# EAGLE design LoopV2.6 (EAGLE 9.4.2)
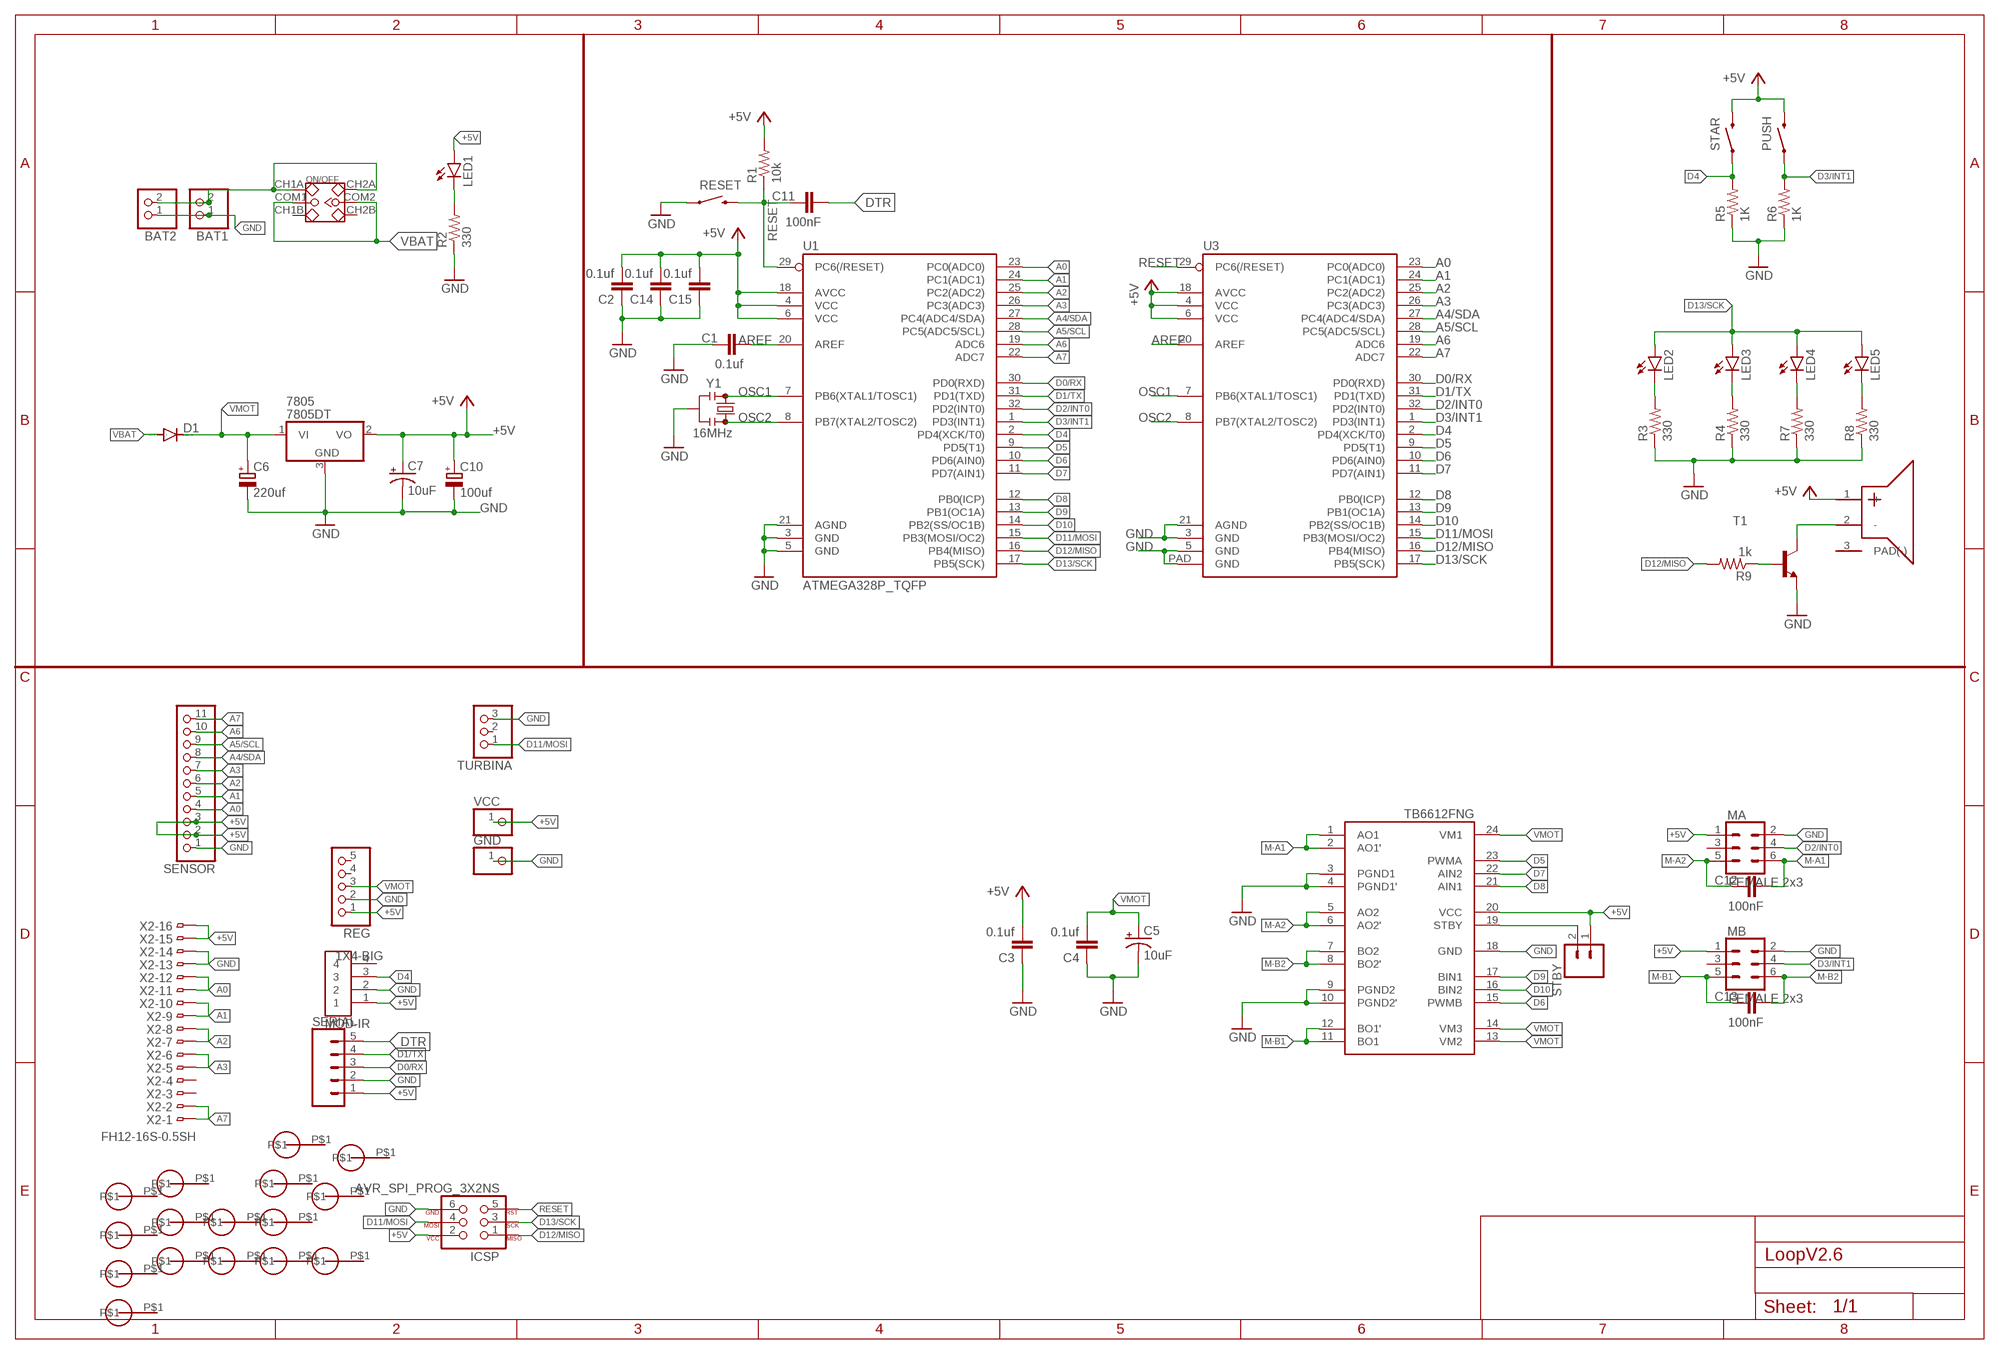
[diagram p0: schematic, sheet 1]

## Parts
7805  7805DT  [TO252]
BAT1  PINHD-1X2  [1X02]
BAT2  PINHD-1X2  [1X02]
C1  0.1uf  C-EUC0805K  [C0805K]
C2  0.1uf  C-EUC0805K  [C0805K]
C3  0.1uf  C-EUC0805K  [C0805K]
C4  0.1uf  C-EUC0805K  [C0805K]
C5  10uF  10UF-POLAR-EIA3216-16V-10%(TANT)  [EIA3216]
C6  220uf  CPOL-EU175TMP-0808  [175TMP-0808]
C7  10uF  10UF-POLAR-EIA3216-16V-10%(TANT)  [EIA3216]
C10  100uf  CPOL-EU153CLV-0605  [153CLV-0605]
C11  100nF  C-EUC0805K  [C0805K]
C12  100nF  C-EUC0805K  [C0805K]
C13  100nF  C-EUC0805K  [C0805K]
C14  0.1uf  C-EUC0805K  [C0805K]
C15  0.1uf  C-EUC0805K  [C0805K]
D1  DIODE-DO214AA  [DO214AA]
GND  PINHD-1X1CB  [1X01-CLEANBIG]
IC1  TB6612FNG  [SSOP24]
ICSP  AVR_SPI_PROG_3X2NS  [2X3-NS]
LED1  LEDCHIPLED_0805  [CHIPLED_0805]
LED2  LEDCHIPLED_0805  [CHIPLED_0805]
LED3  LEDCHIPLED_0805  [CHIPLED_0805]
LED4  LEDCHIPLED_0805  [CHIPLED_0805]
LED5  LEDCHIPLED_0805  [CHIPLED_0805]
MA  FEMALE 2x3  CONN_03X2FEMALE  [2X3]
MB  FEMALE 2x3  CONN_03X2FEMALE  [2X3]
MOD-IR  1X4-BIG  [1X04-BIG]
ON/OFF  SWITCH-8.53.5MM-THT  [SWITCH-8.5*3.5MM-THT]
PUSH  TESTING_SWITCH-MOMENTARY-2SMD  [TESTING_TACTILE_SWITCH_SMD]
R1  10k  R-US_R0805  [R0805]
R2  330  R-US_R0805  [R0805]
R3  330  R-US_R0805  [R0805]
R4  330  R-US_R0805  [R0805]
R5  1K  R-US_R0805  [R0805]
R6  1K  R-US_R0805  [R0805]
R7  330  R-US_R0805  [R0805]
R8  330  R-US_R0805  [R0805]
R9  1k  R-US_R0805  [R0805]
REG  PINHD-1X5  [1X05]
RESET  TESTING_SWITCH-MOMENTARY-2SMD  [TESTING_TACTILE_SWITCH_SMD]
SENSOR  PINHD-1X11  [1X11]
SERIAL  CONN_05  [1X05]
STAR  TESTING_SWITCH-MOMENTARY-2SMD  [TESTING_TACTILE_SWITCH_SMD]
STBY  CONN_02  [1X02]
T1  -NPN-SOT23-EBC  [SOT23-EBC]
TURBINA  PINHD-1X3  [1X03]
U1  ATMEGA328P_TQFP  [TQFP32-08]
U3  ATMEGA328P_MLFMLF32  [MLF32-PAD]
U$4  PAD2  [PAD-2.2MM]
U$5  PAD2  [PAD-2.2MM]
U$6  PAD2  [PAD-2.2MM]
U$7  PAD2  [PAD-2.2MM]
U$8  PAD2  [PAD-2.2MM]
U$9  PAD2  [PAD-2.2MM]
U$10  PAD2  [PAD-2.2MM]
U$11  PAD2  [PAD-2.2MM]
U$12  PAD2  [PAD-2.2MM]
U$13  PAD2  [PAD-2.2MM]
U$14  PAD2  [PAD-2.2MM]
U$15  PAD2  [PAD-2.2MM]
U$16  BUZZER-KLJ-5030  [BUZZERSMD]
U$17  PAD2  [PAD-2.2MM]
U$18  PAD2  [PAD-2.2MM]
U$19  PAD2  [PAD-2.2MM]
U$20  PAD2  [PAD-2.2MM]
VCC  PINHD-1X1CB  [1X01-CLEANBIG]
X2  FH12-16S-0.5SH  [FH12-16S-0.5SH]
Y1  16MHz  RESONATOR-16MHZSMD_3.2X1.3  [RESONATOR-SMD-3.2X1.3]

## Nets
+5V: 7805.2(VO) C2.2 C3.2 C7.+ C10.+ C14.2 C15.2 IC1.20(VCC) ICSP.2 LED1.A MA.1 MB.1 MOD-IR.1 PUSH.3 R1.2 REG.1 SENSOR.2 SENSOR.3 SERIAL.1 STAR.3 STBY.1 U1.4(VCC) U1.6(VCC) U1.18(AVCC) U3.4(VCC) U3.6(VCC) U3.18(AVCC) U$16.1(+) VCC.1 X2.15 X2.16
A0: SENSOR.4 U1.23(PC0(ADC0)) U3.23(PC0(ADC0)) X2.11 X2.12
A1: SENSOR.5 U1.24(PC1(ADC1)) U3.24(PC1(ADC1)) X2.9 X2.10
A2: SENSOR.6 U1.25(PC2(ADC2)) U3.25(PC2(ADC2)) X2.7 X2.8
A3: SENSOR.7 U1.26(PC3(ADC3)) U3.26(PC3(ADC3)) X2.5 X2.6
A4/SDA: SENSOR.8 U1.27(PC4(ADC4/SDA)) U3.27(PC4(ADC4/SDA))
A5/SCL: SENSOR.9 U1.28(PC5(ADC5/SCL)) U3.28(PC5(ADC5/SCL))
A6: SENSOR.10 U1.19(ADC6) U3.19(ADC6)
A7: SENSOR.11 U1.22(ADC7) U3.22(ADC7) X2.1 X2.2
AREF: C1.2 U1.20(AREF) U3.20(AREF)
D0/RX: SERIAL.3 U1.30(PD0(RXD)) U3.30(PD0(RXD))
D1/TX: SERIAL.4 U1.31(PD1(TXD)) U3.31(PD1(TXD))
D2/INT0: MA.4 U1.32(PD2(INT0)) U3.32(PD2(INT0))
D3/INT1: MB.4 PUSH.1 R6.2 U1.1(PD3(INT1)) U3.1(PD3(INT1))
D4: MOD-IR.3 R5.2 STAR.1 U1.2(PD4(XCK/T0)) U3.2(PD4(XCK/T0))
D5: IC1.23(PWMA) U1.9(PD5(T1)) U3.9(PD5(T1))
D6: IC1.15(PWMB) U1.10(PD6(AIN0)) U3.10(PD6(AIN0))
D7: IC1.22(AIN2) U1.11(PD7(AIN1)) U3.11(PD7(AIN1))
D8: IC1.21(AIN1) U1.12(PB0(ICP)) U3.12(PB0(ICP))
D9: IC1.17(BIN1) U1.13(PB1(OC1A)) U3.13(PB1(OC1A))
D10: IC1.16(BIN2) U1.14(PB2(SS/OC1B)) U3.14(PB2(SS/OC1B))
D11/MOSI: ICSP.4 TURBINA.1 U1.15(PB3(MOSI/OC2)) U3.15(PB3(MOSI/OC2))
D12/MISO: ICSP.1 R9.2 U1.16(PB4(MISO)) U3.16(PB4(MISO))
D13/SCK: ICSP.3 LED2.A LED3.A LED4.A LED5.A U1.17(PB5(SCK)) U3.17(PB5(SCK))
DTR: C11.2 SERIAL.5
GND: 7805.3(GND) BAT1.1 BAT2.1 C1.1 C2.1 C3.1 C4.1 C5.- C6.- C7.- C10.- C14.1 C15.1 GND.1 IC1.3(PGND1) IC1.4(PGND1') IC1.9(PGND2) IC1.10(PGND2') IC1.18(GND) ICSP.6 MA.2 MB.2 MOD-IR.2 R2.1 R3.1 R4.1 R5.1 R6.1 R7.1 R8.1 REG.2 RESET.1 SENSOR.1 SERIAL.2 T1.E TURBINA.3 U1.3(GND) U1.5(GND) U1.21(AGND) U3.3(GND) U3.5(GND) U3.21(AGND) U3.PAD(GND) X2.13 X2.14 Y1.2
M-A1: C12.2 IC1.1(AO1) IC1.2(AO1') MA.6
M-A2: C12.1 IC1.5(AO2) IC1.6(AO2') MA.5
M-B1: C13.1 IC1.11(BO1) IC1.12(BO1') MB.5
M-B2: C13.2 IC1.7(BO2) IC1.8(BO2') MB.6
N$1: LED1.C R2.2
N$3: T1.C U$16.2(-)
N$4: LED4.C R7.2
N$5: LED2.C R3.2
N$6: LED3.C R4.2
N$7: LED5.C R8.2
N$9: R9.1 T1.B
N$10: IC1.19(STBY) STBY.2
N$12: BAT1.2 BAT2.2 ON/OFF.CH1A ON/OFF.CH2A
OSC1: U1.7(PB6(XTAL1/TOSC1)) U3.7(PB6(XTAL1/TOSC1)) Y1.1
OSC2: U1.8(PB7(XTAL2/TOSC2)) U3.8(PB7(XTAL2/TOSC2)) Y1.3
RESET: C11.1 ICSP.5 R1.1 RESET.3 U1.29(PC6(/RESET)) U3.29(PC6(/RESET))
VBAT: D1.A ON/OFF.COM1 ON/OFF.COM2
VMOT: 7805.1(VI) C4.2 C5.+ C6.+ D1.C IC1.13(VM2) IC1.14(VM3) IC1.24(VM1) REG.3
Unconnected: MA.3 MB.3 MOD-IR.4 ON/OFF.CH1B ON/OFF.CH2B REG.4 REG.5 TURBINA.2 U$4.P$1 U$5.P$1 U$6.P$1 U$7.P$1 U$8.P$1 U$9.P$1 U$10.P$1 U$11.P$1 U$12.P$1 U$13.P$1 U$14.P$1 U$15.P$1 U$16.3(PAD(-)) U$17.P$1 U$18.P$1 U$19.P$1 U$20.P$1 X2.3 X2.4

## Library data of the parts
7805 = adafruit:78*: Positive VOLTAGE REGULATOR Added bigger pads to the TO-92 package
BAT1 BAT2 = pinhead:PINHD-1X2: PIN HEADER
C1-C4 C11-C15 = rcl:C-EU: CAPACITOR, European symbol; SPICEPREFIX: C
C5 C7 = SparkFun-Capacitors:10UF-POLAR: 10.0µF polarized capacitors A capacitor is a passive two-terminal electrical component used to store electrical energy temporarily in an electric field.; PROD_ID: CAP-00811
C6 C10 = rcl:CPOL-EU: POLARIZED CAPACITOR, European symbol; SPICEPREFIX: C
D1 = diode:DIODE-: DIODE
GND VCC = adafruit:PINHD-1X1: Pin header 1x1 for 0.1" spacing With round pins
IC1 = adafruit:TB6612FNG: TB6612FNG MOS dual H-bridge motor driver, 1.2A current 3.2A peak 3 or 5v logic and 3-15v motor
ICSP = SparkFun-Connectors:AVR_SPI_PROG_3X2: AVR ISP 6 Pin This is the reduced ISP connector for AVR programming. Common on Arduino. This footprint will take up less PCB space and can be used with a 10-pin to 6-pin adapter such as SKU: BOB-08508 **Special note about "TEST_POINT" package. The stop mask is on the top side, so if you want your programming test points to be on the bottom of your board, make sure to place this package on the bottom side of the board. This also ensure that the orientation to program from the bottom side will be correct. SparkFun Products: SparkFun ISP Pogo Adapter - NS Tiny AVR Programmer -PTH
LED1-LED5 = led:LED: LED OSRAM: - CHIPLED LG R971, LG N971, LY N971, LG Q971, LY Q971, LO R971, LY R971 LH N974, LH R974 LS Q976, LO Q976, LY Q976 LO Q996 - Hyper CHIPLED LW Q18S LB Q993, LB Q99A, LB R99A - SideLED LS A670, LO A670, LY A670, LG A670, LP A670 LB A673, LV A673, LT A673, LW A673 LH A674 LY A675 LS A676, LA A676, LO A676, LY A676, LW A676 LS A679, LY A679, LG A679 - Hyper Micro SIDELED® LS Y876, LA Y876, LO Y876, LY Y876 LT Y87S - SmartLED LW L88C, LW L88S LB L89C, LB L89S, LG L890 LS L89K, LO L89K, LY L89K LS L896, LA L896, LO L896, LY L896 - TOPLED LS T670, LO T670, LY T670, LG T670, LP T670 LSG T670, LSP T670, LSY T670, LOP T670, LYG T670 LG T671, LOG T671, LSG T671 LB T673, LV T673, LT T673, LW T673 LH T674 LS T676, LA T676, LO T676, LY T676, LB T676, LH T676, LSB T676, LW T676 LB T67C, LV T67C, LT T67C, LS T67K, LO T67K, LY T67K, LW E67C LS E67B, LA E67B, LO E67B, LY E67B, LB E67C, LV E67C, LT E67C LW T67C LS T679, LY T679, LG T679 LS T770, LO T770, LY T770, LG T770, LP T770 LB T773, LV T773, LT T773, LW T773 LH T774 LS E675, LA E675, LY E675, LS T675 LS T776, LA T776, LO T776, LY T776, LB T776 LHGB T686 LT T68C, LB T68C - Hyper Mini TOPLED® LB M676 - Mini TOPLED Santana® LG M470 LS M47K, LO M47K, LY M47K Source: http://www.osram.convergy.de LUXEON: - LUMILED® LXK2-PW12-R00, LXK2-PW12-S00, LXK2-PW14-U00, LXK2-PW14-V00 LXK2-PM12-R00, LXK2-PM12-S00, LXK2-PM14-U00 LXK2-PE12-Q00, LXK2-PE12-R00, LXK2-PE12-S00, LXK2-PE14-T00, LXK2-PE14-U00 LXK2-PB12-K00, LXK2-PB12-L00, LXK2-PB12-M00, LXK2-PB14-N00, LXK2-PB14-P00, LXK2-PB14-Q00 LXK2-PR12-L00, LXK2-PR12-M00, LXK2-PR14-Q00, LXK2-PR14-R00 LXK2-PD12-Q00, LXK2-PD12-R00, LXK2-PD12-S00 LXK2-PH12-R00, LXK2-PH12-S00 LXK2-PL12-P00, LXK2-PL12-Q00, LXK2-PL12-R00 Source: www.luxeon.com KINGBRIGHT: KA-3528ASYC Source: www.kingbright.com
MA MB = SparkFun-Connectors:CONN_03X2: Multi connection point. Often used as Generic Header-pin footprint for 0.1 inch spaced/style header connections You can populate with any combo of single row headers, but if you'd like an exact match, check these: Header - 2x3 (Male, 0.1") (PRT-12807) Header - 2x3 (Female, 0.1") (PRT-13010) 2x3 Pin Shrouded Header (PRT-10877) On any of the 0.1 inch spaced packages, you can populate with these: Break Away Headers - Straight (PRT-00116) Break Away Male Headers - Right Angle (PRT-00553) Female Headers (PRT-00115) Break Away Headers - Machine Pin (PRT-00117) Break Away Female Headers - Swiss Machine Pin (PRT-00743) Special note: the shrouded connector mates well with our 3x2 ribbon cables: Ribbon Crimp Connector - 6-pin (2x3, Female) (PRT-10651) Ribbon Cable - 6 wire (15ft) (PRT-10646); PROD_ID: CONN-11566
MOD-IR = adafruit:1X4: 4-pin connector
ON/OFF = Switch-JR:SWITCH-8.5*3.5MM-THT: 311010004; MPN: MS-22D18 G2 ROHS
PUSH RESET STAR = PUSH-SMD:TESTING_SWITCH-MOMENTARY-2: Various NO switches- pushbuttons, reed, etc; PROD_ID: SWCH-08247
R1-R9 = rcl:R-US_: RESISTOR, American symbol; SPICEPREFIX: R
REG = pinhead:PINHD-1X5: PIN HEADER
SENSOR = pinhead:PINHD-1X11: PIN HEADER
SERIAL = SparkFun-Connectors:CONN_05: Multi connection point. Often used as Generic Header-pin footprint for 0.1 inch spaced/style header connections On any of the 0.1 inch spaced packages, you can populate with these: Break Away Headers - Straight (PRT-00116) Break Away Male Headers - Right Angle (PRT-00553) Female Headers (PRT-00115) Break Away Headers - Machine Pin (PRT-00117) Break Away Female Headers - Swiss Machine Pin (PRT-00743) For SCREWTERMINALS and SPRING TERMINALS visit here: Screw Terimnals on SparkFun.com (5mm/3.5mm/2.54mm spacing) This device is also useful as a general connection point to wire up your design to another part of your project. Our various solder wires solder well into these plated through hole pads. Hook-Up Wire - Assortment (Stranded, 22 AWG) (PRT-11375) Hook-Up Wire - Assortment (Solid Core, 22 AWG) (PRT-11367) View the entire wire category on our website here Special notes: Molex polarized connector foot print use with SKU : PRT-08231 with associated crimp pins and housings. 1MM SMD Version SKU: PRT-10208
STBY = SparkFun-Connectors:CONN_02: Multi connection point. Often used as Generic Header-pin footprint for 0.1 inch spaced/style header connections On any of the 0.1 inch spaced packages, you can populate with these: Break Away Headers - Straight (PRT-00116) Break Away Male Headers - Right Angle (PRT-00553) Female Headers (PRT-00115) Break Away Headers - Machine Pin (PRT-00117) Break Away Female Headers - Swiss Machine Pin (PRT-00743) For SCREWTERMINALS and SPRING TERMINALS visit here: Screw Terimnals on SparkFun.com (5mm/3.5mm/2.54mm spacing) This device is also useful as a general connection point to wire up your design to another part of your project. Our various solder wires solder well into these plated through hole pads. Hook-Up Wire - Assortment (Stranded, 22 AWG) (PRT-11375) Hook-Up Wire - Assortment (Solid Core, 22 AWG) (PRT-11367) View the entire wire category on our website here Special notes: Molex polarized connector foot print use with: PRT-08233 with associated crimp pins and housings. 2.54_SCREWTERM for use with PRT-10571. 3.5mm Screw Terminal footprints for PRT-08084 5mm Screw Terminal footprints for use with PRT-08432
T1 = transistor-neu-to92:*-NPN-: NPN Transistror
TURBINA = adafruit:PINHD-1X3: PIN HEADER
U1 = SparkFun-IC-Microcontroller:ATMEGA328P_TQFP: Popular 328P in QFP Storefront component: ATmega328 - TQFP (COM-13448) Datasheet SparkFun Products SparkFun RedBoard - Programmed with Arduino (DEV-12757) Arduino Pro Mini 328 - 5V/16MHz (DEV-11113) Arduino Pro Mini 328 - 3.3V/8MHz (DEV-11114) SparkFun OpenLog (DEV-13712) SparkFun MicroView - OLED Arduino Module (DEV-12923) SparkFun Digital Sandbox (DEV-12651) SparkFun PicoBoard (WIG-11888) Arduino Fio (DEV-10116) LilyPad Arduino 328 Main Board (DEV-13342) SparkFun RedStick (DEV-13741) LilyPad MP3 (DEV-11013) LilyPad Arduino SimpleSnap (DEV-10941) SparkFun Stepoko (ROB-13899) SparkFun Geiger Counter (SEN-11345) SparkFun EL Sequencer (COM-12781) Arduino Pro 328 - 5V/16MHz (DEV-10915) CryptoCape (DEV-12773) SparkFun IR Thermometer Evaluation Board - MLX90614 (SEN-10740) SparkFun RedBot Mainboard (ROB-12097) Arduino Pro 328 - 3.3V/8MHz (DEV-10914) SparkFun Block for Intel® Edison - Arduino (DEV-13036) SparkFun Simon Says - Surface Mount Soldering Kit (KIT-10935) SparkFun 7-Segment Serial Display - Red (COM-11441) SparkFun 7-Segment Serial Display - White (COM-11629) SparkFun 7-Segment Serial Display - Yellow (COM-11443) SparkFun 7-Segment Serial Display - Kelly Green (COM-11440) SparkFun 7-Segment Serial Display - Blue (COM-11442) SparkFun OpenSegment Serial Display - 20mm (Blue) (COM-11647) SparkFun OpenSegment Serial Display - 20mm (Green) (COM-11646) SparkFun OpenSegment Serial Display - 20mm (White) (COM-11648) SparkFun OpenSegment Serial Display - 20mm (Red) (COM-11644) SparkFun OpenSegment Serial Display - 20mm (Yellow) (COM-11645) SparkFun OpenSegment Shield (DEV-13190); PROD_ID: IC-09069
U3 = SparkFun-IC-Microcontroller:ATMEGA328P_MLF: Datasheet SparkFun Products () () 32-Pin Atmega328 part Commonly used on Arduino compatible boards Available in QFP and QFN packages TQFP is IC-09069 QFN is non-stock
U$4-U$15 U$17-U$20 = Pads-JR:PAD2
U$16 = ComponentesJR:BUZZER-KLJ-5030
X2 = con-hirose:FH12-16S-0.5S: 0.5mm Pitch Connectors For FPC/FFC Source: Data sheet; MPN: FH12-16S-0.5SH(55); OC_FARNELL: 1324546; OC_NEWARK: 34M6162
Y1 = SparkFun-Clocks:RESONATOR-16MHZ: 16MHz Resonator Digikey Example <http://www.digikey.com/product-detail/en/murata-electronics-north-america/CSTCE16M0V53-R0/490-1198-1-ND/584635> Frequency: 16MHz Frequency Stability: ±0.3% Frequency Tolerance: ±0.5% Capacitance: 15pF SparkFun Products SparkFun OpenLog <https://www.sparkfun.com/products/13712> SparkFun MicroView - OLED Arduino Module <https://www.sparkfun.com/products/12923>; PROD_ID: XTAL-08900

## Board
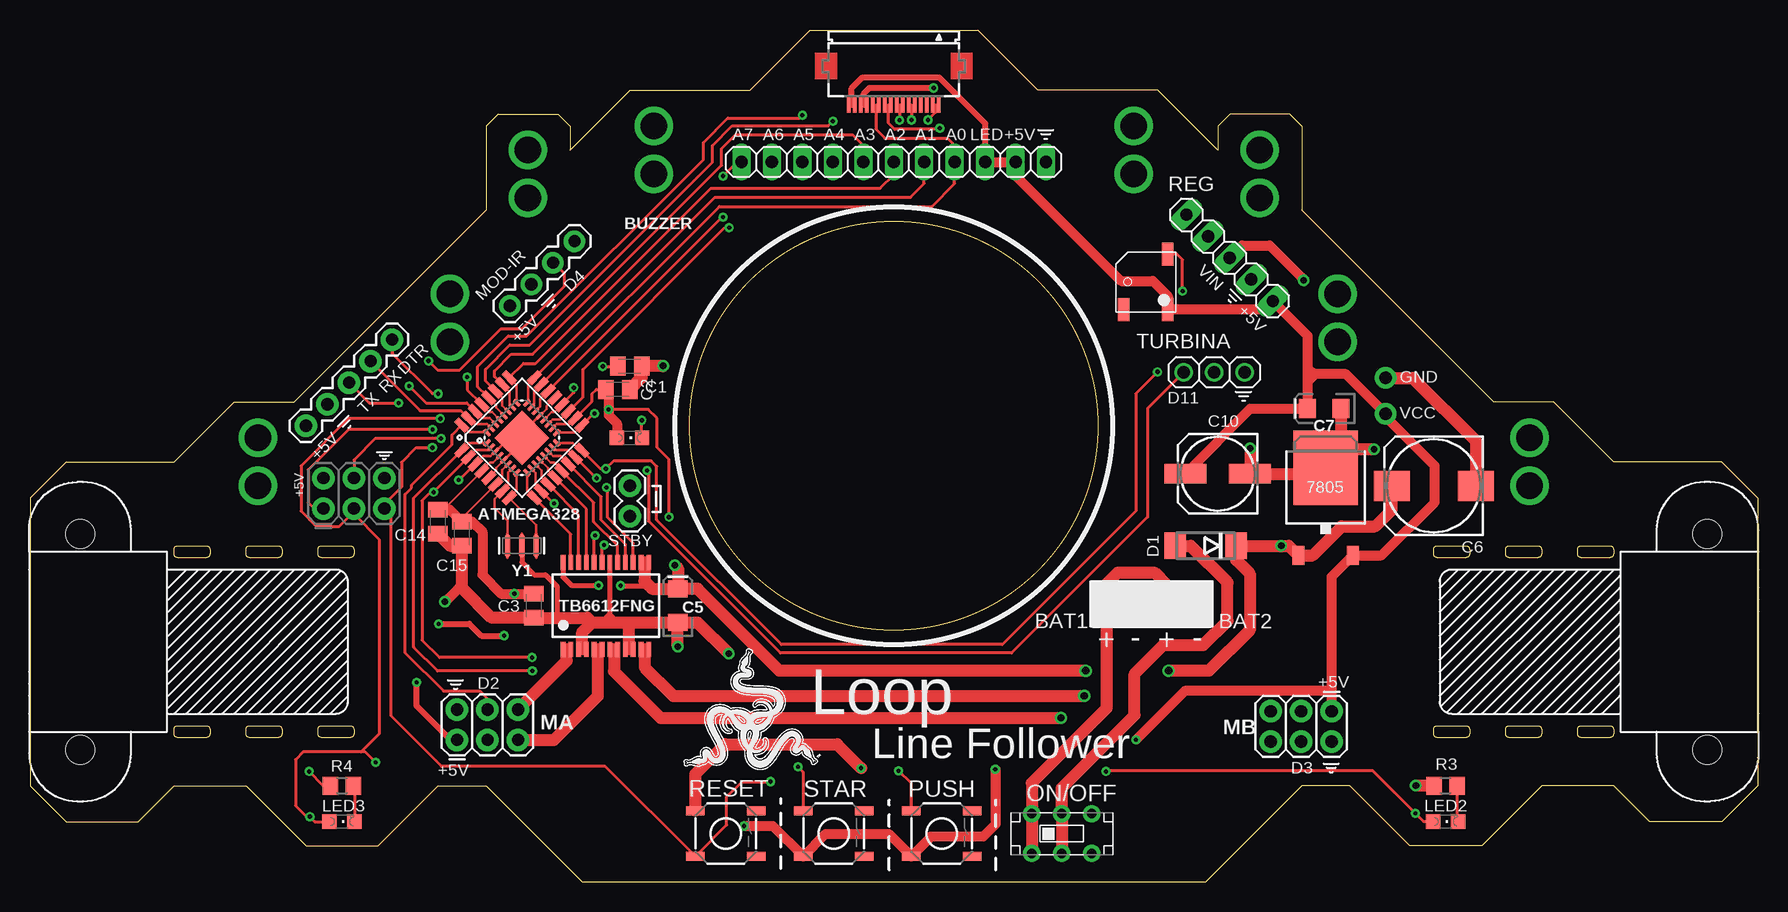
[diagram p1: board, top side]
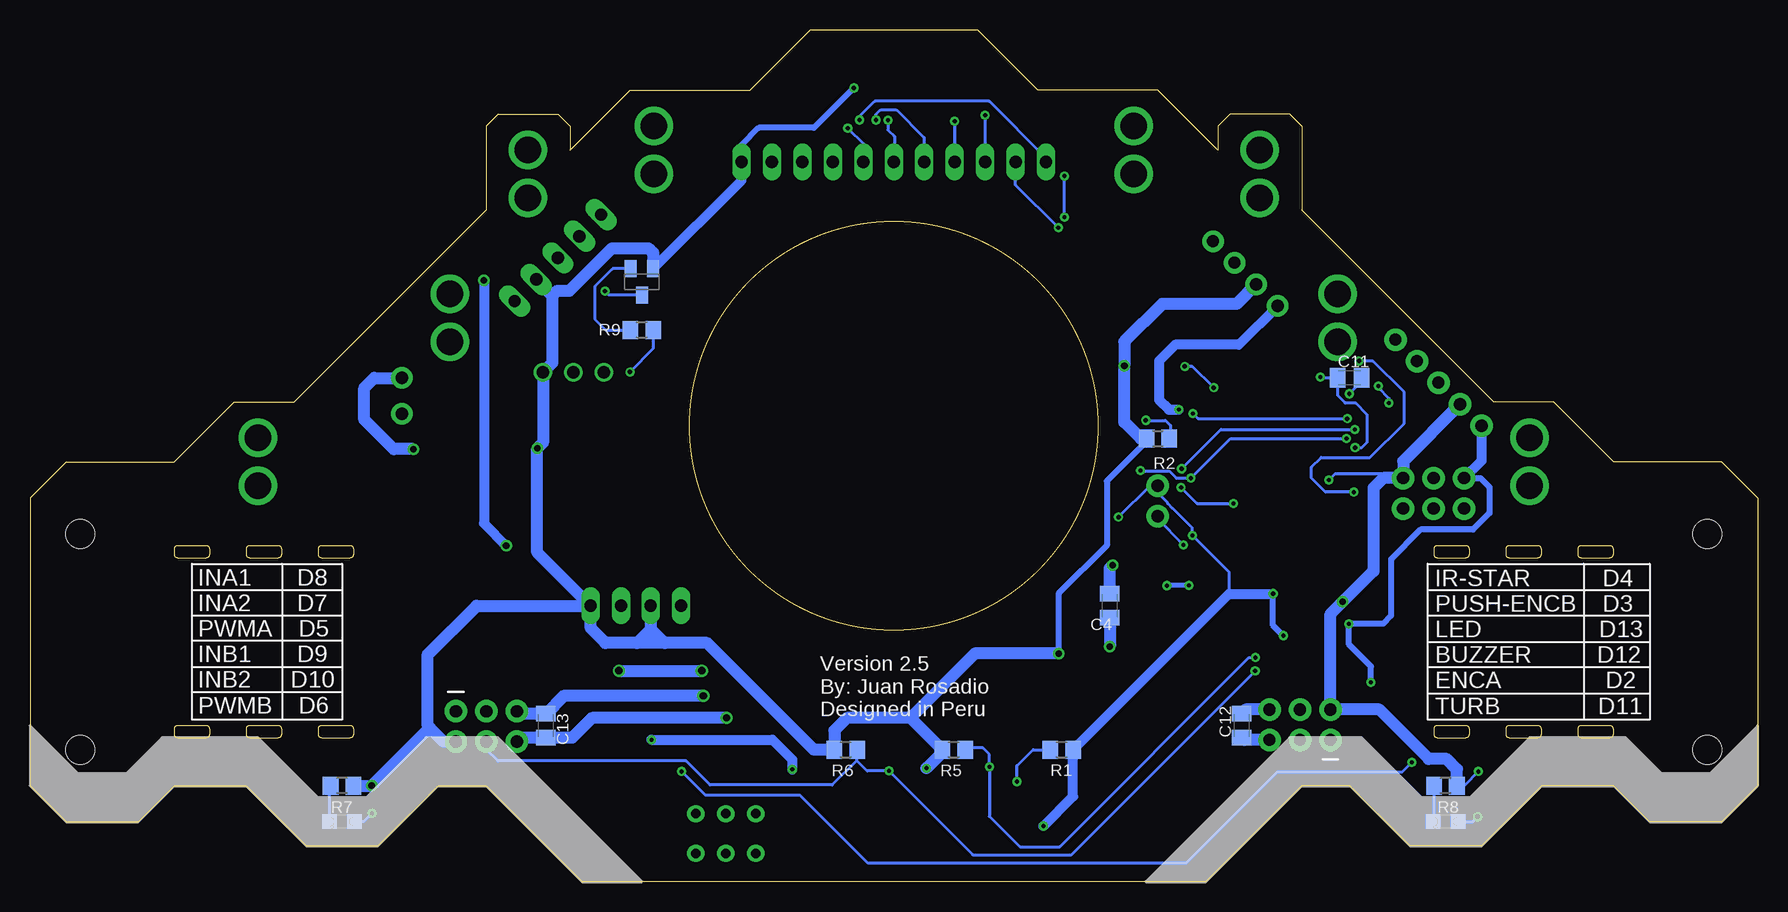
[diagram p2: board, bottom side, seen from below]

Size 144 x 71 mm. Coordinates in mm from the lower left corner, seen from the top.
Outline: 144 segments
Outline: circle at 72,38 radius 17
Copper layers (1*16): Top 0.035mm / dielectric 1.5mm / Bottom 0.035mm
Design rules "default *": minimum track width 8mil, minimum drill 0.35mm, track to track 6mil, track to pad 6mil, pad to pad 6mil, via to via 6mil, smd to smd 6mil, copper to edge 40mil, drill to drill 6mil, minimum pad ring 10mil, minimum via ring 8mil, stop-mask expansion 4mil, vias tented up to drill 0mil, thermal gap 10mil

### Footprints (pad centres in the part's own frame; a part is rotated, then mirrored left to right if it is on the bottom)
TO252 = smd 1 x 1.6: 1 -2.28,-4.8; 2 2.28,-4.8 | smd 5.4 x 6.2: 3 0,2.5
1X02 = drill 1.016 long: 1 -1.27,0; 2 1.27,0
C0805K = smd 1.3 x 1.6: 1 -1,0; 2 1,0
EIA3216 = smd 1.4 x 1.6: + 1.4,0; - -1.4,0
175TMP-0808 = smd 3 x 2.5: + 3.5,0; - -3.5,0
153CLV-0605 = smd 3.5 x 1.6: + 2.7,0; - -2.7,0
DO214AA = smd 1.8 x 2.2: A 2.55,0; C -2.55,0
1X01-CLEANBIG = drill 1.016 pad 1.778: 1 0,0
SSOP24 = smd 0.4 x 1.25: 1 -3.575,-3.625; 2 -2.925,-3.625; 3 -2.275,-3.625; 4 -1.625,-3.625; 5 -0.975,-3.625; 6 -0.325,-3.625; 7 0.325,-3.625; 8 0.975,-3.625; 9 1.625,-3.625; 10 2.275,-3.625; 11 2.925,-3.625; 12 3.575,-3.625; 13 3.575,3.625; 14 2.925,3.625; 15 2.275,3.625; 16 1.625,3.625; 17 0.975,3.625; 18 0.325,3.625; 19 -0.325,3.625; 20 -0.975,3.625; 21 -1.625,3.625; 22 -2.275,3.625; 23 -2.925,3.625; 24 -3.575,3.625
2X3-NS = drill 1.016 pad 1.88: 1 -2.54,-1.27; 2 -2.54,1.27; 3 0,-1.27; 4 0,1.27; 5 2.54,-1.27; 6 2.54,1.27
CHIPLED_0805 = smd 1.2 x 1.2: A 0,-1.05; C 0,1.05
2X3 = drill 1.016 pad 1.88: 1 0,0; 2 0,2.54; 3 2.54,0; 4 2.54,2.54; 5 5.08,0; 6 5.08,2.54
1X04-BIG = drill 1.016 pad 1.778: 1 0,0; 2 2.54,0; 3 5.08,0; 4 7.62,0
SWITCH-8.5*3.5MM-THT = drill 0.8 pad 1.422: CH1A -2.5,-1.65; CH1B 2.5,-1.65; CH2A -2.5,1.65; CH2B 2.5,1.65; COM1 0,-1.65; COM2 0,1.65
TESTING_TACTILE_SWITCH_SMD = smd 1.524 x 0.762: 1 -2.54,1.905; 2 2.54,1.905; 3 -2.54,-1.905; 4 2.54,-1.905
R0805 = smd 1.3 x 1.5: 1 -0.95,0; 2 0.95,0
1X05 = drill 1.016 long: 1 -5.08,0; 2 -2.54,0; 3 0,0; 4 2.54,0; 5 5.08,0
1X11 = drill 1.016 long: 1 -12.7,0; 2 -10.16,0; 3 -7.62,0; 4 -5.08,0; 5 -2.54,0; 6 0,0; 7 2.54,0; 8 5.08,0; 9 7.62,0; 10 10.16,0; 11 12.7,0
1X05' = drill 1.016 pad 1.88: 1 0,0; 2 2.54,0; 3 5.08,0; 4 7.62,0; 5 10.16,0
1X02' = drill 1.016 pad 1.88: 1 0,0; 2 2.54,0
SOT23-EBC = smd 1 x 1.4: B 0.95,-1.1; C 0,1.1; E -0.95,-1.1
1X03 = drill 1.016: 1 -2.54,0; 2 0,0; 3 2.54,0
TQFP32-08 = smd 1.27 x 0.559: 1 -4.293,2.8; 2 -4.293,2; 3 -4.293,1.2; 4 -4.293,0.4; 5 -4.293,-0.4; 6 -4.293,-1.2; 7 -4.293,-2; 8 -4.293,-2.8; 17 4.293,-2.8; 18 4.293,-2; 19 4.293,-1.2; 20 4.293,-0.4; 21 4.293,0.4; 22 4.293,1.2; 23 4.293,2; 24 4.293,2.8 | smd 0.559 x 1.27: 9 -2.8,-4.293; 10 -2,-4.293; 11 -1.2,-4.293; 12 -0.4,-4.293; 13 0.4,-4.293; 14 1.2,-4.293; 15 2,-4.293; 16 2.8,-4.293; 25 2.8,4.293; 26 2,4.293; 27 1.2,4.293; 28 0.4,4.293; 29 -0.4,4.293; 30 -1.2,4.293; 31 -2,4.293; 32 -2.8,4.293
MLF32-PAD = smd 0.7 x 0.3: 1 -2.35,1.75; 2 -2.35,1.25; 3 -2.35,0.75; 4 -2.35,0.25; 5 -2.35,-0.25; 6 -2.35,-0.75; 7 -2.35,-1.25; 8 -2.35,-1.75; 17 2.35,-1.75; 18 2.35,-1.25; 19 2.35,-0.75; 20 2.35,-0.25; 21 2.35,0.25; 22 2.35,0.75; 23 2.35,1.25; 24 2.35,1.75 | smd 0.3 x 0.7: 9 -1.75,-2.35; 10 -1.25,-2.35; 11 -0.75,-2.35; 12 -0.25,-2.35; 13 0.25,-2.35; 14 0.75,-2.35; 15 1.25,-2.35; 16 1.75,-2.35; 25 1.75,2.35; 26 1.25,2.35; 27 0.75,2.35; 28 0.25,2.35; 29 -0.25,2.35; 30 -0.75,2.35; 31 -1.25,2.35; 32 -1.75,2.35 | smd 3.2 x 3.2: PAD 0,0
MOTORPOLOLU = hole 2.4: -9,-4.18; 9,-4.18
PAD-2.2MM = drill 2.2: P$1 0,0
BUZZERSMD = smd 1.93 x 0.965: 1 -2.3,-1.85; 2 2.3,-1.85; 3 -2.3,1.85
FH12-16S-0.5SH = smd 0.3 x 1.3: 1 -3.75,3.25; 2 -3.25,3.25; 3 -2.75,3.25; 4 -2.25,3.25; 5 -1.75,3.25; 6 -1.25,3.25; 7 -0.75,3.25; 8 -0.25,3.25; 9 0.25,3.25; 10 0.75,3.25; 11 1.25,3.25; 12 1.75,3.25; 13 2.25,3.25; 14 2.75,3.25; 15 3.25,3.25; 16 3.75,3.25
RESONATOR-SMD-3.2X1.3 = smd 0.45 x 1.905: 1 -1.2,0; 2 0,0; 3 1.2,0

### Placement (x,y rotation side)
7805  108,32 0 top
BAT1  91,23 180 top
BAT2  96,23 180 top
C1  49.99,42.97 180 top
C2  49.01,41.03 180 top
C3  42,23 90 top
C4  54,23 90 bottom
C5  54,23 90 top
C6  117,33 180 top
C7  107.88,39.43 180 top
C10  99,34 180 top
C11  34,42 0 bottom
C12  43,13 90 bottom
C13  101,13 270 bottom
C14  34,30 90 top
C15  36,29 90 top
D1  98,28 180 top
GND  113,42 0 top
IC1  48,23 0 top
ICSP  27,32.37 0 top
LED1  49.97,36.99 270 top
LED2  118,5 270 top
LED3  26,5 270 top
LED4  118,5 90 bottom
LED5  26,5 90 bottom
MA  35.6,11.8 0 top
MB  108.5,14.2 180 top
MOD-IR  40,48 45 top
ON/OFF  86,4 0 top
PUSH  76,4 0 top
R1  58,11 0 bottom
R2  49.98,36.93 0 bottom
R3  118,8 0 top
R4  26,8 0 top
R5  67,11 0 bottom
R6  76,11 0 bottom
R7  117.99,8 180 bottom
R8  26.01,8 180 bottom
R9  93,46 0 bottom
REG  100,52 135 top
RESET  58,4 0 top
SENSOR  72,60 180 top
SERIAL  [1X05']  23,38 45 top
STAR  67,4 0 top
STBY  [1X02']  50,33 270 top
T1  93,50 180 bottom
TURBINA  98.71,42.46 0 top
U1  41,37 45 top
U3  41,37 45 top
U$1  [MOTORPOLOLU]  0,20 90 top
U$2  [MOTORPOLOLU]  144,20 270 top
U$3  [RAZER-1]  60,13 45 top
U$4  41.5,57 0 top
U$5  102.5,61 0 top
U$6  35,49 0 top
U$7  52,63 0 top
U$8  125,37 0 top
U$9  19,37 180 top
U$10  19,33 0 top
U$11  125,33 0 top
U$12  41.5,61 0 top
U$13  52,59 0 top
U$14  102.5,57 0 top
U$15  109,49 0 top
U$16  93,50 90 top
U$17  92,59 0 top
U$18  92,63 0 top
U$19  35,45 0 top
U$20  109,45 0 top
VCC  113,39 0 top
X2  72,68 180 top
Y1  41,28 0 top

### Tracks (layer width: path | path; a pad name or v marks a point on that pad's centre or on a via)
+5V  (via drill 0.35)
  Top 0.203: U3.4 38.6,34.95 38.34,34.95 37.68,34.29 U1.4 34.43,31 C14.2 | U3.6 39.36,34.3 39.36,33.66 U1.6 36,30.3 C15.2 | U3.18 43.89,38.13 44.95,38.13 U1.18
  Top 0.254: X2.16 68.52,64.75 X2.15 | IC1.20 47.02,28.77 v47.11,28.86 | U1.18 46.85,40.03 46.85,40.67 47.22,41.03 C2.2 | v53.25,30.38 53.25,35.21 52.26,36.2 52.26,38.63 51.53,39.37 48.26,39.37 v48.24,39.35
  Top 0.508: 68.52,64.75 68.5,64.78 68.5,66.14 69.41,67.06 75.78,67.06 79.62,63.22 SENSOR.3 | v34.05,21.49 36.62,21.49 37.61,20.5 v39.51,20.5 | MA.1 35.08,11.8 32.22,14.66 v32.22,16.61
  Top 0.813: C10.+ 101.73,39.43 C7.+ 106.48,41.65 | 106.48,42.83 106.48,45.52 REG.1 102.88,47.7 U$16.1 94.85,48.8 93.59,50.06 90.95,50.06 82.16,58.85 SENSOR.2 SENSOR.3 | 106.48,42.83 106.48,42.29 | 106.48,42.29 106.48,41.91 | 106.48,41.91 106.48,41.65 | C2.2 48.24,40.8 v48.24,39.35 48.24,38.88 48.92,38.19 LED1.A | C14.2 35,31 C15.2 36.87,30 37.71,29.16 37.71,25.58 39.29,24 v40.38,24 C3.2 | 107.13,42.29 109.71,42.29 VCC.1 113,38.73 117.09,34.65 117.09,31.62 112.66,27.2 7805.2 108.5,25.42 108.5,15.88 | 106.86,42.29 106.48,42.29 | 107.13,42.29 107.02,42.29 | 107.02,42.29 106.48,42.83 | 107.02,42.29 106.86,42.29 | 106.86,42.29 106.48,41.91 | 107.13,42.29 106.48,41.65 | MB.1 108.5,15.88 | 108.5,15.88 96.26,15.88 v92.19,11.81 | v80.46,9.35 80.48,9.35 80.48,4.78 79.44,3.73 75.1,3.73 PUSH.3 71.59,3.96 66.33,3.96 STAR.3 61.93,4.62 v59.53,4.62
  Bottom 0.254: 44.05,24 44.05,25.8 v47.11,28.86 47.11,29.49 48.74,31.12 48.78,31.12 49.16,31.5 49.16,31.55 50,32.38 STBY.1 50.64,33 v53.25,30.38
  Bottom 0.508: ICSP.2 23.08,33.63 22.34,32.89 22.34,30.71 23.72,29.34 28.08,29.34 30.55,26.88 30.55,22.15 31.21,21.49 v34.05,21.49 34.05,19.76 32.22,17.93 v32.22,16.61 | v39.51,20.5 40.38,21.36 v40.38,24
  Bottom 0.813: v92.19,11.81 82.11,11.81 80.46,10.16 v80.46,9.35 | v59.53,4.62 57.05,7.1 R1.2 44.05,24 v40.38,24 | ICSP.2 23,35.09 SERIAL.1 | MOD-IR.1 43.24,44.76 48.53,44.76 49.88,43.41 49.88,40.16 49.06,39.35 v48.24,39.35
A0
  Top 0.203: U3.23 42.03,39.8 42.03,40.86 U1.23
  Top 0.254: U1.23 57.46,56.29 75.17,56.29 77.08,58.19 SENSOR.4 77.08,61.39 76.5,61.98 71.26,61.98 70.5,62.74 70.5,64.72 70.53,64.75 | X2.12 70.53,64.75 | 70.53,64.75 X2.11
A1  (via drill 0.35)
  Top 0.203: U3.24 41.52,39.99 41.52,41.48 U1.24
  Top 0.254: U1.24 57.09,57.05 73.4,57.05 74.54,58.19 SENSOR.5 | X2.10 X2.9 71.52,64.75 71.52,63.27 72.08,62.71 75.73,62.71 v75.83,62.82
  Bottom 0.254: v75.83,62.82 74.54,61.52 SENSOR.5
A2  (via drill 0.35)
  Top 0.203: U3.25 40.58,41.38 U1.25
  Top 0.254: U1.25 41.14,43.21 42.16,43.21 56.76,57.81 70.86,57.81 72,58.95 SENSOR.6 | X2.8 72.48,64.75 | X2.7 72.48,64.75 | 72.48,64.75 v72.48,63.47
  Bottom 0.254: v72.48,63.47 72.48,62.66 71.95,62.13 71.95,60.05 SENSOR.6
A3  (via drill 0.35)
  Top 0.203: U3.26 40,39.77 40,40.83 U1.26
  Top 0.254: U1.26 38.73,42.1 38.73,42.57 40.12,43.97 41.9,43.97 57.65,59.72 57.65,61.11 58.79,62.26 68.57,62.26 69.46,61.37 SENSOR.7 | X2.6 73.47,64.75 | 73.47,64.75 X2.5 | 73.47,64.75 v73.47,63.5
  Bottom 0.254: v73.47,63.5 73.47,63.96 73.09,64.34 71.77,64.34 69.46,62.03 SENSOR.7
A4/SDA  (via drill 0.35)
  Top 0.203: U3.27 39.36,39.7 39.36,40.34 U1.27
  Top 0.254: U1.27 37.96,41.73 37.96,42.7 40,44.73 41.65,44.73 56.89,59.97 56.89,61.37 58.54,63.02 66.54,63.02 v66.92,63.4
  Bottom 0.254: v66.92,63.4 SENSOR.8
A5/SCL  (via drill 0.35)
  Top 0.203: U3.28 38.85,39.5 38.85,39.71 38.06,40.51
  Top 0.254: U1.28 38.06,40.51 37.33,41.24 37.33,42.95 39.87,45.49 41.42,45.49 56.12,60.2 56.12,61.62 58.16,63.65 64.13,63.65 v64.38,63.91
  Bottom 0.254: v64.38,63.91 SENSOR.9
A6  (via drill 0.35)
  Top 0.203: U3.19 43.57,38.51 44.2,38.51 U1.19
  Top 0.254: U1.19 46.09,40.4 46.09,42.7 57.9,54.51 v58.28,54.51
  Bottom 0.254: v58.28,54.51 61.84,58.07 SENSOR.10
A7  (via drill 0.35)
  Top 0.203: U3.22 42.54,39.6 42.54,40.23 U1.22
  Top 0.254: U1.22 57.7,55.4 v57.78,55.4 | v57.78,58.83 58.95,60 SENSOR.11 | X2.1 75.48,64.75 | 75.48,64.75 X2.2 | v74.84,63.5 75.48,64.14 75.48,64.75
  Bottom 0.254: v57.78,55.4 v57.78,58.83 | SENSOR.11 59.3,60.33 64.02,65.05 73.59,65.05 74.84,63.8 v74.84,63.5
AREF  (via drill 0.35)
  Top 0.203: U3.20 43.5,39.14 43.71,39.14 U1.20
  Top 0.254: U1.20 45.33,40.76 v45.33,41.17 | v47.74,42.95 48.97,42.95 C1.2
  Bottom 0.254: v45.33,41.17 47.11,42.95 v47.74,42.95
D0/RX  (via drill 0.35)
  Top 0.203: U3.30 38.3,38.63 37.67,38.63 U1.30
  Top 0.254: SERIAL.3 28.28,39.91 v30.73,39.91 | v31.61,41.3 33.01,39.91 36.4,39.91 U1.30
  Bottom 0.254: v30.73,39.91 30.73,40.29 31.61,41.17 v31.61,41.3
D1/TX
  Top 0.203: U3.31 38.1,38.13 37.05,38.13 U1.31
  Top 0.254: SERIAL.4 32.51,39.27 35.9,39.27 U1.31
D2/INT0
  Top 0.203: U3.32 38.03,37.49 36.55,37.49 U1.32
  Top 0.254: U1.32 35.17,37.24 35.17,36.42 31.79,33.05 31.79,32.82 31.26,32.28 31.26,19.08 34.46,15.88 37.51,15.88 38.14,15.24 MA.4
D3/INT1  (via drill 0.35)
  Top 0.203: U1.1 36.62,36.58 U3.1
  Top 0.254: PUSH.1 73.46,8.17 v72.41,9.22 | v41.88,17.55 33.98,17.55 31.99,19.53 31.99,31.98 35.96,35.95 U1.1
  Bottom 0.254: 75.05,10.06 74.21,9.22 v72.41,9.22 65.4,2.21 57.19,2.21 41.88,17.53 v41.88,17.55 | 75.05,10.06 R6.2 | 75.05,10.06 75.12,10.06 77.13,8.05 87.32,8.05 89.32,10.06 105,10.06 105.96,11.02 MB.4
D4  (via drill 0.35)
  Top 0.203: U3.2 38.2,35.97 37.14,35.97 U1.2
  Top 0.254: STAR.1 64.46,9.12 v64.02,9.55 | v41.85,18.67 34.13,18.67 32.68,20.12 32.68,31.75 33.39,32.46 v33.63,32.46 U1.2 | v33.21,43.41 33.98,42.65 35.83,42.65 39.28,46.1 41.01,46.1 44.54,49.63 44.54,50.7 43.65,51.59 MOD-IR.3
  Bottom 0.254: R5.2 65.92,11.13 64.56,11.13 64.02,10.59 v64.02,9.55 64.02,5.44 61.48,2.9 58.16,2.9 42.38,18.67 v41.85,18.67 | v33.63,32.46 36.01,32.46 37.18,33.63 37.18,34.55 36.36,35.36 32.3,35.36 29.45,38.2 29.45,40.79 32.07,43.41 v33.21,43.41
D5
  Top 0.203: U3.9 41.42,32.62 U1.9
  Top 0.254: IC1.23 45.08,28.96 U1.9
D6  (via drill 0.35)
  Top 0.203: U3.10 42.16,34.08 42.16,33.02 U1.10
  Top 0.254: IC1.15 50.27,28.23 48.12,30.38 48.12,32.77 v48.05,32.84 | v43.68,31.52 43.65,31.52 U1.10
  Bottom 0.254: v48.05,32.84 46.73,31.52 v43.68,31.52
D7
  Top 0.203: U3.11 42.66,34.28 42.66,33.64 43.34,32.96
  Top 0.254: IC1.22 45.73,30.58 43.34,32.96 U1.11
D8
  Top 0.203: U3.12 43.17,34.48 43.17,34.26 U1.12
  Top 0.254: IC1.21 46.38,31.06 U1.12
D9
  Top 0.203: U3.13 43.4,34.95 43.68,34.95 44.32,34.31 U1.13
  Top 0.254: IC1.17 48.98,28.01 46.98,30 46.98,31.59 U1.13
D10
  Top 0.203: U3.14 43.6,35.46 44.24,35.46 U1.14
  Top 0.254: IC1.16 49.62,28.12 47.62,30.13 47.62,32.08 U1.14
D11/MOSI  (via drill 0.35)
  Top 0.203: U3.15 43.8,35.97 44.86,35.97 U1.15
  Top 0.254: U1.15 47.2,33.63 v47.23,33.63 | v34.26,36.93 28.77,36.93 27,35.16 ICSP.4 | TURBINA.1 93.16,39.46 93.16,30.38 81.83,19.05 62.55,19.05 51.55,30.05 51.55,34.14 v51.43,34.27
  Bottom 0.254: v34.26,36.93 43.93,36.93 v47.23,33.63 48.45,33.63 49.04,34.22 51.38,34.22 v51.43,34.27
D12/MISO  (via drill 0.35)
  Top 0.203: U3.16 45.23,36.58 45.86,35.95 U1.16
  Top 0.254: U1.16 47.54,34.42 v48,34.42 48.66,35.08 51.78,35.08 52.24,34.62 52.24,30.15 62.63,19.76 81.04,19.76 92.17,30.89 92.17,40.67 v94,42.5 | v33.57,37.7 26.56,37.7 23.18,34.32 23.18,31.6 23.69,31.09 ICSP.1
  Bottom 0.254: v48,34.42 44.72,37.7 v33.57,37.7 | R9.2 92.05,44.44 v94,42.5
D13/SCK  (via drill 0.35)
  Top 0.203: U3.17 45.38,37.42 U1.17
  Top 0.254: U1.17 46.98,39.02 v47.07,39.02 | v34.2,38.59 26.54,38.59 22.6,34.65 22.6,30.89 23.87,29.62 25.77,29.62 27,30.85 ICSP.3 27,30.62 29.12,28.5 29.12,12.32 27.6,10.8 | v23.33,5.41 23.36,5.39 | 23.36,5.39 23.74,5 LED5.A | 27.6,10.8 22.77,10.8 22.14,10.16 22.14,6.33 23.08,5.39 23.36,5.39 | LED4.A 116.18,5 v115.48,5.69 111.95,9.22 89.73,9.22 v89.68,9.17 | v28.82,9.93 27.96,10.8 27.6,10.8
  Bottom 0.254: v47.07,39.02 46.64,38.59 v34.2,38.59 | LED5.A 23.74,5 v23.33,5.41 | v115.48,5.69 116.18,5 LED4.A | v89.68,9.17 87.72,7.21 79.85,7.21 74.18,1.55 47.62,1.55 40.02,9.15 29.61,9.15 v28.82,9.93
DTR  (via drill 0.35)
  Top 0.254: SERIAL.5 30.18,44.04 33.56,40.67 v34.03,40.67
  Bottom 0.254: v34.03,40.67 33,41.69 C11.2
GND  (via drill 0.35, 0.55)
  Top 0.203: U3.3 38.4,35.46 37.76,35.46 U1.3 | U3.5 38.85,34.5 38.85,34.29 U1.5 | U3.21 43.04,39.4 43.04,39.65 43.71,40.32 U1.21
  Top 0.254: X2.14 69.56,64.75 X2.13 | U3.PAD 41,37.35 U3.21 40.66,37.01 40.66,37 | U3.3 39.94,37 40.66,37 | 40.66,37 U3.PAD | U3.5 41,36.65 U3.PAD | R4.1 24.45,8 v23.28,9.17 | U1.3 35.78,33.48 v35.73,33.48
  Top 0.406: IC1.3 46.04,19.38 IC1.4 | IC1.9 49.95,19.38 IC1.10 | IC1.18 48.33,22.28 | 48.33,22.28 48.33,21.7 48.43,21.6 | 48.33,22.28 47.65,21.6 47.64,21.6 | 48.33,22.28 48.94,21.67 48.94,21.6 | Y1.2 41,26.61 42.03,25.58 42.97,25.58 43.93,24.61 43.93,22
  Top 0.508: 69.56,64.75 69.48,64.83 69.48,65.69 69.97,66.17 v75.33,66.17
  Top 0.813: v34.59,23.32 35.76,24.49 36,24.49
  Top 1.016: GND.1 115.27,42 120.5,36.77 C6.- | C7.- 109.28,35.78 7805.3 | 7805.3 107.5,34 C10.- 101.72,34.02 v101.72,36.12 | 7805.3 109.54,36.04 v112.06,36.04 | v53.99,19.59 C5.- | 46.04,19.38 46.04,20.78 46.86,21.6 | 46.86,21.6 47.64,21.6 48.43,21.6 48.94,21.6 49.9,21.6 | 49.9,21.6 C5.- | 49.95,19.38 49.95,21.55 49.9,21.6 | C5.- 55.66,21.6 v58.26,19 | 46.86,21.6 46.46,22 43.93,22 C3.1 38.49,22 36,24.49 C15.1 35,28 C14.1 | RESET.1 55.46,8.96 57.95,11.46 67.28,11.46 v69.28,9.45 | C2.1 50.99,42.01 C1.1 52.74,42.97 v52.77,43 | R3.1 v115.52,8
  Bottom 0.254: v23.28,9.17 24.45,8 R8.1 | v35.73,33.48 35.19,34.02 29.92,34.02 ICSP.6
  Bottom 0.508: v75.33,66.17 78.66,62.84 83.25,62.84 84.7,61.39 SENSOR.1 | R2.1 50.93,36.7 54.25,33.39 54.25,28.02 58.26,24.01 v58.26,19
  Bottom 0.813: T1.E 84.7,58.45 SENSOR.1
  Bottom 1.016: BAT1.1 92.27,21.03 | 93.41,19.89 92.27,21.03 | 93.41,19.89 96.03,19.89 97.27,21.13 BAT2.1 | v112.06,36.04 113.68,36.04 116.15,38.51 116.15,41.15 115.3,42 GND.1 | REG.2 100.45,48.86 | 100.45,48.86 100.45,43.26 TURBINA.3 101.25,36.59 v101.72,36.12 101.72,27.45 BAT2.1 | MB.2 109.52,11.66 110.69,12.83 | 110.69,12.83 110.84,12.98 110.84,18.95 106.79,23 BAT2.1 | 91.1,19.89 87.55,19.89 78.66,11 R6.1 76.95,12.6 75.91,13.64 70.59,13.64 | 91.1,19.89 93.41,19.89 | 92.27,21.03 92.24,21.03 91.1,19.89 | 70.59,13.64 R5.1 67.95,10.78 v69.28,9.45 | C4.1 v54,19.59 v53.99,19.59 | v58.26,19 65.23,19 70.59,13.64 | R8.1 25.06,9.37 25.9,10.21 27.4,10.21 31.52,14.34 MA.2 35.6,22.3 v34.59,23.32 32.02,25.88 32.02,32.82 31.2,33.63 ICSP.6 29.54,35.05 SERIAL.2 | R2.1 51.4,36.93 52.77,38.3 v52.77,43 52.77,45.01 49.62,48.16 43.43,48.16 MOD-IR.2 | 100.45,48.86 100.05,49.25 99.03,49.25 95.47,52.81 92.45,52.81 92.05,52.41 T1.E | R7.1 v115.52,8 110.69,12.83
M-A1
  Top 0.406: IC1.1 44.75,19.38 IC1.2
  Top 1.016: MA.6 44.75,18.41 44.75,19.38
  Bottom 1.016: MA.6 42.66,14.34 C12.2
M-A2
  Top 0.406: IC1.5 47.34,19.38 IC1.6
  Top 1.016: MA.5 43.68,11.8 47.34,15.46 47.34,19.38
  Bottom 1.016: MA.5 42.8,11.8 C12.1
M-B1  (via drill 0.6)
  Top 0.406: IC1.11 51.25,19.38 IC1.12
  Top 1.016: 51.25,19.38 51.25,17.86 53.64,15.47 v87.88,15.47
  Bottom 1.016: v87.88,15.47 99.53,15.47 C13.1 103.22,14 MB.5
M-B2  (via drill 0.6)
  Top 0.406: IC1.7 48.68,19.38 IC1.8
  Top 1.016: 48.68,19.38 48.68,17.53 52.57,13.64 v85.94,13.64
  Bottom 1.016: v85.94,13.64 97.15,13.64 98.8,11.99 C13.2 103.08,12 MB.6
N$1  (via drill 0.35)
  Top 0.254: LED1.C 50.99,37.01 v50.99,38.46
  Bottom 0.254: v50.99,38.46 49.37,38.46 48.94,38.02 48.94,37.02 R2.2
N$3  (via drill 0.35)
  Top 0.254: v96.08,49.23 96.08,51.84 95.62,52.3 U$16.2
  Bottom 0.254: T1.C 95.75,48.9 v96.08,49.23
N$4
  Bottom 0.254: R7.2 119.05,7.89 LED4.C
N$5
  Top 0.254: R3.2 118.95,5.1 LED2.C
N$6
  Top 0.254: R4.2 27.05,7.9 LED3.C
N$7
  Bottom 0.254: R8.2 26.96,5.09 LED5.C
N$9
  Bottom 0.254: T1.B 95.42,51.1 96.92,49.61 96.92,46.91 96,46 R9.1
N$10  (via drill 0.35)
  Top 0.254: IC1.19 47.67,27.88 v47.86,28.07
  Bottom 0.254: v47.86,28.07 50,30.21 STBY.2
N$12
  Top 1.016: ON/OFF.CH1A ON/OFF.CH2A 83.5,8.23 89.73,14.45 BAT1.2 89.73,24.82 90.67,25.76 93.72,25.76 94.73,24.74 BAT2.2
OSC1
  Top 0.203: U3.7 39.87,34.1 39.87,33.04 U1.7 38.73,31.9 38.73,31.14 39.8,30.07 Y1.1
OSC2
  Top 0.203: U3.8 40.58,32.62 U1.8 42.2,29.73 Y1.3
RESET  (via drill 0.35)
  Top 0.203: U3.29 38.5,39.14 38.29,39.14 37.56,39.88
  Top 0.254: v36.44,42.06 36.44,40.99 37.56,39.88 U1.29 | v61.74,8.33 59.35,8.33 58.08,7.06 58.08,4.72 RESET.3 47.95,9.6 34.31,9.6 30.12,13.79 30.12,30.52 ICSP.5 29.54,31.46 31,32.92 31,34.93 30.98,34.95 32.2,36.17 v33.54,36.17
  Bottom 0.254: v36.44,42.06 36.38,42 C11.1 35,40.52 34.36,39.88 33.49,39.88 32.53,38.91 32.53,36.63 32.99,36.17 v33.54,36.17 | v61.74,8.33 61.74,9.65 60.39,11 R1.1
VBAT
  Top 1.016: ON/OFF.COM1 ON/OFF.COM2 86,7.8 92.07,13.87 92.07,17.3 94.48,19.71 97.78,19.71 99.81,21.74 99.81,24.92 96.73,28 D1.A
VMOT  (via drill 0.35, 0.55, 0.6)
  Top 0.254: IC1.14 51.22,26.62 IC1.13
  Top 0.406: IC1.24 44.42,25.39 45.13,24.69 v47.39,24.69 | v49.24,24.66 50.84,24.66 | 50.84,24.66 51.22,25.05 | 50.84,24.66 51.5,24.66 51.55,24.72
  Top 0.813: REG.3 101.04,53.04 103.34,53.04 106.16,50.22 v106.16,50.12
  Top 1.016: C6.+ 113.5,30.99 112.13,29.62 109.34,29.62 106.92,27.2 7805.1 104.92,28 v104.31,28 D1.C 100.55,26.8 101.67,25.68 101.67,20.96 98.29,17.58 v94.91,17.58 | 51.22,26.62 51.22,25.05 51.55,24.72 51.87,24.4 C5.+ | v88,17.58 62.48,17.58 55.65,24.4 C5.+ | v53.76,26.37 54,26.13 C5.+
  Bottom 0.406: v47.39,24.69 49.22,24.69 v49.24,24.66
  Bottom 0.813: v106.16,50.12 106.16,29.85 v104.31,28
  Bottom 1.016: v94.91,17.58 v88,17.58 | C4.2 54,26.13 v53.76,26.37

### Text on the board
tPlace: A7 | A6 | A5 | A4 | A3 | A2 | A1 | A0 | LED | +5V | BUZZER | VIN | D4 | +5V | DTR | +5V | RX | D11 | TX | +5V | +5V | ATMEGA328 | TB6612FNG | - | - | + | + | D2 | +5V | Loop | Line Follower | +5V | D3
bPlace: Version 2.5 / By: Juan Rosadio / Designed in Peru | INA1 D8 / INA2 D7 / PWMA D5 / INB1 D9 / INB2 D10 / PWMB D6 | IR-STAR D4 / PUSH-ENCB D3 / LED D13 / BUZZER D12 / ENCA D2 / TURB D11